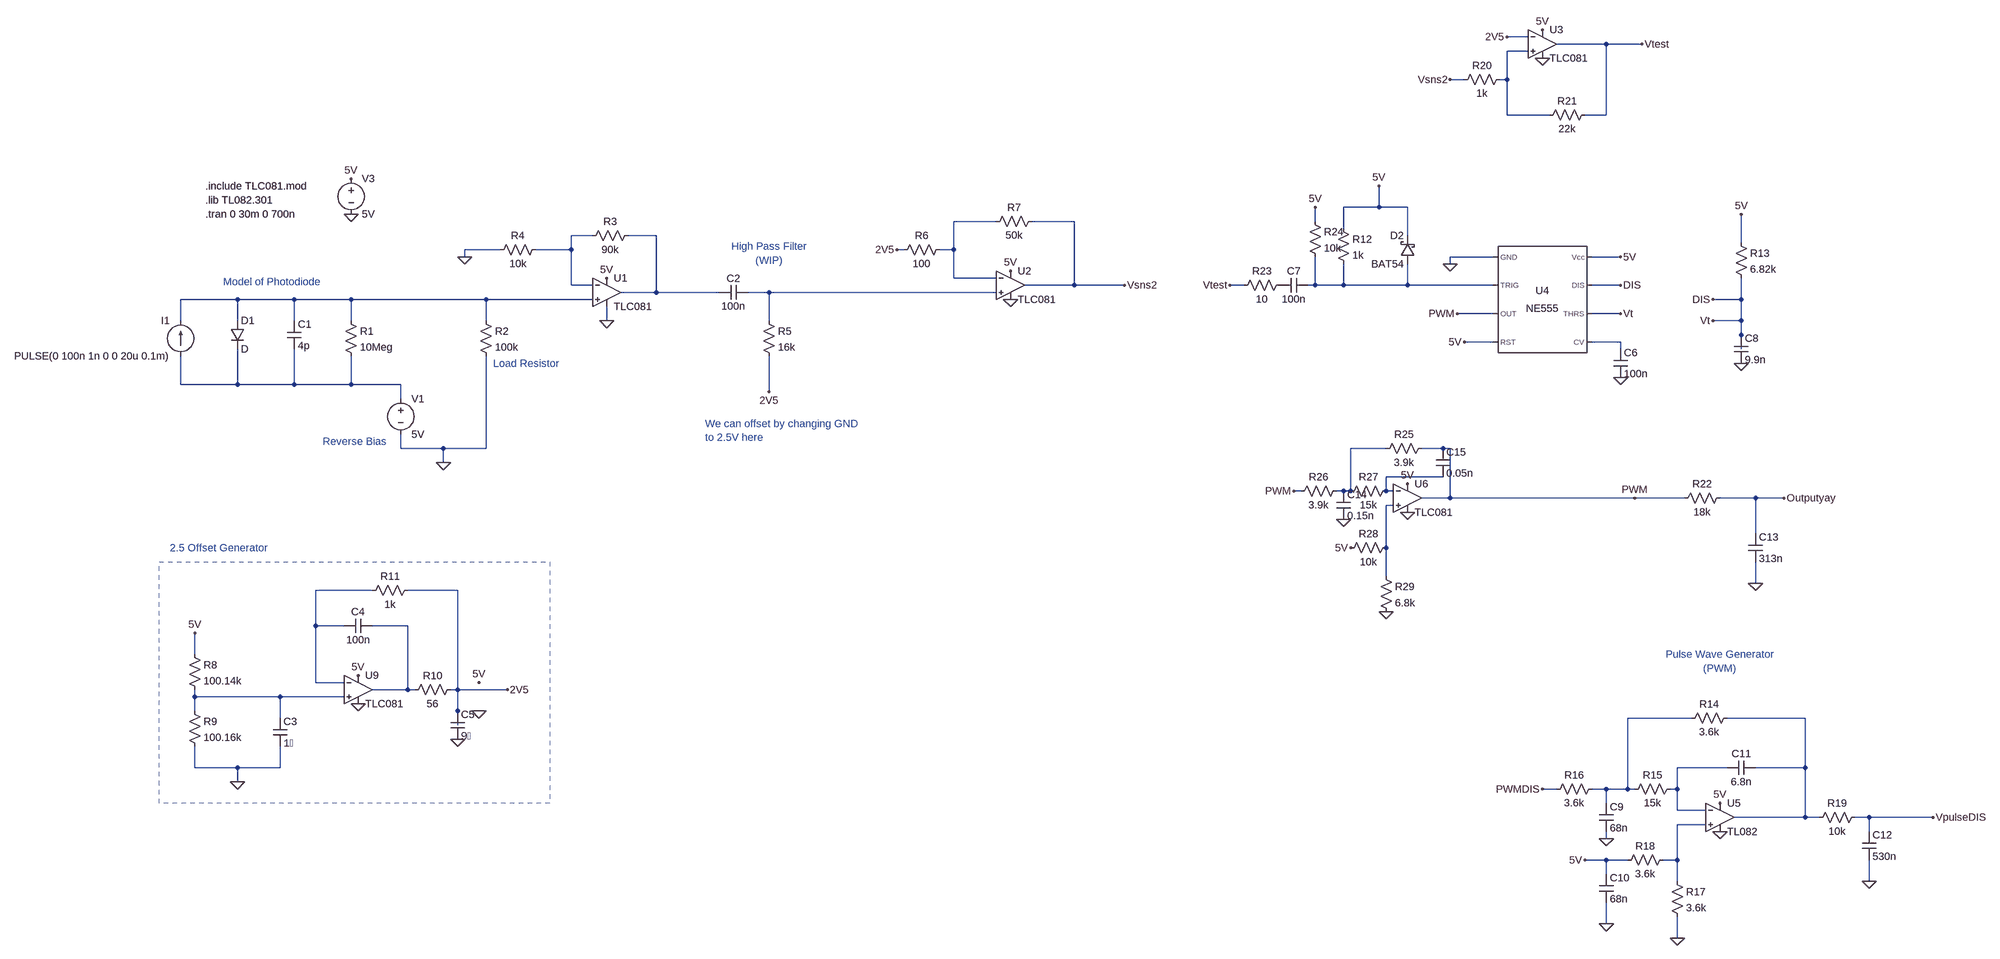
[diagram p0: schematic alternative_rx.asc]
alternative_rx.asc, the LTspice schematic file:
Version 4
SHEET 1 5060 1620
WIRE 3264 -432 3216 -432
WIRE 3440 -416 3328 -416
WIRE 3520 -416 3440 -416
WIRE 3264 -400 3216 -400
WIRE 3120 -336 3088 -336
WIRE 3216 -336 3216 -400
WIRE 3216 -336 3200 -336
WIRE 3216 -256 3216 -336
WIRE 3312 -256 3216 -256
WIRE 3440 -256 3440 -416
WIRE 3440 -256 3392 -256
WIRE 2928 -48 2928 -96
WIRE 2928 -48 2848 -48
WIRE 2992 -48 2928 -48
WIRE 1984 -16 1888 -16
WIRE 2160 -16 2064 -16
WIRE 2784 -16 2784 -48
WIRE 2848 0 2848 -48
WIRE 1056 16 1008 16
WIRE 1200 16 1136 16
WIRE 2992 16 2992 -48
WIRE 3744 32 3744 -32
WIRE 848 48 768 48
WIRE 1008 48 1008 16
WIRE 1008 48 928 48
WIRE 1776 48 1760 48
WIRE 1888 48 1888 -16
WIRE 1888 48 1856 48
WIRE 768 64 768 48
WIRE 3184 64 3088 64
WIRE 3472 64 3408 64
WIRE 3088 80 3088 64
WIRE 1888 112 1888 48
WIRE 1984 112 1888 112
WIRE 1008 128 1008 48
WIRE 1056 128 1008 128
WIRE 2160 128 2160 -16
WIRE 2160 128 2048 128
WIRE 2336 128 2160 128
WIRE 2624 128 2592 128
WIRE 2784 128 2784 64
WIRE 2784 128 2768 128
WIRE 2848 128 2848 80
WIRE 2848 128 2784 128
WIRE 2992 128 2992 80
WIRE 2992 128 2848 128
WIRE 3184 128 2992 128
WIRE 3472 128 3408 128
WIRE 1200 144 1200 16
WIRE 1200 144 1120 144
WIRE 1360 144 1200 144
WIRE 1472 144 1424 144
WIRE 1984 144 1472 144
WIRE 256 160 128 160
WIRE 384 160 256 160
WIRE 512 160 384 160
WIRE 816 160 512 160
WIRE 1056 160 816 160
WIRE 3744 160 3744 112
WIRE 3744 160 3680 160
WIRE 3184 192 3104 192
WIRE 3472 192 3408 192
WIRE 128 208 128 160
WIRE 256 208 256 160
WIRE 384 208 384 160
WIRE 512 208 512 160
WIRE 816 208 816 160
WIRE 1088 208 1088 176
WIRE 1472 208 1472 144
WIRE 3744 208 3744 160
WIRE 3744 208 3680 208
WIRE 3744 240 3744 208
WIRE 3184 256 3120 256
WIRE 3472 256 3408 256
WIRE 3472 272 3472 256
WIRE 3744 272 3744 240
WIRE 128 352 128 288
WIRE 256 352 256 272
WIRE 256 352 128 352
WIRE 384 352 384 272
WIRE 384 352 256 352
WIRE 512 352 512 288
WIRE 512 352 384 352
WIRE 624 352 512 352
WIRE 1472 368 1472 288
WIRE 624 384 624 352
WIRE 624 496 624 464
WIRE 720 496 624 496
WIRE 816 496 816 288
WIRE 816 496 720 496
WIRE 2944 496 2864 496
WIRE 3072 496 3024 496
WIRE 3088 496 3072 496
WIRE 720 528 720 496
WIRE 3072 560 2944 560
WIRE 2752 592 2736 592
WIRE 2848 592 2832 592
WIRE 2864 592 2864 496
WIRE 2864 592 2848 592
WIRE 2944 592 2944 560
WIRE 2960 592 2944 592
WIRE 3088 608 3088 496
WIRE 3088 608 3024 608
WIRE 3504 608 3088 608
WIRE 3616 608 3504 608
WIRE 3776 608 3696 608
WIRE 3840 608 3776 608
WIRE 2960 624 2944 624
WIRE 3776 688 3776 608
WIRE 2944 720 2944 624
WIRE 2944 784 2944 720
WIRE 3776 800 3776 752
WIRE 560 816 432 816
WIRE 752 816 640 816
WIRE 432 896 432 816
WIRE 496 896 432 896
WIRE 640 896 560 896
WIRE 160 960 160 912
WIRE 432 1024 432 896
WIRE 496 1024 432 1024
WIRE 640 1040 640 896
WIRE 640 1040 560 1040
WIRE 656 1040 640 1040
WIRE 752 1040 752 816
WIRE 752 1040 736 1040
WIRE 864 1040 752 1040
WIRE 160 1056 160 1040
WIRE 352 1056 160 1056
WIRE 496 1056 352 1056
WIRE 160 1088 160 1056
WIRE 752 1088 752 1040
WIRE 352 1104 352 1056
WIRE 3632 1104 3488 1104
WIRE 3888 1104 3712 1104
WIRE 752 1120 752 1088
WIRE 160 1216 160 1168
WIRE 256 1216 160 1216
WIRE 352 1216 352 1168
WIRE 352 1216 256 1216
WIRE 3712 1216 3600 1216
WIRE 3888 1216 3888 1104
WIRE 3888 1216 3776 1216
WIRE 256 1248 256 1216
WIRE 3328 1264 3296 1264
WIRE 3440 1264 3408 1264
WIRE 3488 1264 3488 1104
WIRE 3488 1264 3440 1264
WIRE 3504 1264 3488 1264
WIRE 3600 1264 3600 1216
WIRE 3600 1264 3584 1264
WIRE 3440 1296 3440 1264
WIRE 3600 1312 3600 1264
WIRE 3664 1312 3600 1312
WIRE 3888 1328 3888 1216
WIRE 3888 1328 3728 1328
WIRE 3920 1328 3888 1328
WIRE 4032 1328 4000 1328
WIRE 4176 1328 4032 1328
WIRE 3664 1344 3600 1344
WIRE 4032 1360 4032 1328
WIRE 3440 1376 3440 1360
WIRE 3440 1424 3392 1424
WIRE 3488 1424 3440 1424
WIRE 3600 1424 3600 1344
WIRE 3600 1424 3568 1424
WIRE 3440 1456 3440 1424
WIRE 3600 1472 3600 1424
WIRE 4032 1472 4032 1424
WIRE 3440 1568 3440 1520
WIRE 3600 1600 3600 1552
FLAG 720 528 0
FLAG 1088 208 0
FLAG 768 64 0
FLAG 1760 48 2V5
FLAG 2336 128 Vsns2
FLAG 512 -32 0
FLAG 512 -112 5V
FLAG 160 912 5V
FLAG 256 1248 0
FLAG 752 1152 0
FLAG 864 1040 2V5
FLAG 3088 80 0
FLAG 3472 336 0
FLAG 3472 192 Vt
FLAG 3472 128 DIS
FLAG 3472 64 5V
FLAG 2928 -96 5V
FLAG 3120 256 5V
FLAG 3104 192 PWM
FLAG 3744 304 0
FLAG 3680 160 DIS
FLAG 3680 208 Vt
FLAG 3744 -32 5V
FLAG 3600 1600 0
FLAG 3440 1376 0
FLAG 3440 1568 0
FLAG 3392 1424 5V
FLAG 3296 1264 PWMDIS
FLAG 4032 1472 0
FLAG 4176 1328 VpulseDIS
FLAG 1472 368 2V5
FLAG 3088 -336 Vsns2
FLAG 3216 -432 2V5
FLAG 3520 -416 Vtest
FLAG 1088 112 5V
FLAG 2016 96 5V
FLAG 2016 160 0
FLAG 800 1088 0
FLAG 800 1024 5V
FLAG 3296 -384 0
FLAG 3296 -448 5V
FLAG 528 1072 0
FLAG 528 1008 5V
FLAG 3696 1360 0
FLAG 3696 1296 5V
FLAG 3504 608 PWM
FLAG 3776 800 0
FLAG 3840 608 Outputyay
FLAG 2592 128 Vtest
FLAG 2784 -48 5V
FLAG 2992 576 5V
FLAG 2992 640 0
FLAG 2736 592 PWM
FLAG 2848 656 0
FLAG 2864 720 5V
FLAG 2944 864 0
SYMBOL current 128 288 R180
WINDOW 0 24 80 Left 2
WINDOW 3 24 0 Left 2
WINDOW 123 0 0 Left 0
WINDOW 39 0 0 Left 0
SYMATTR InstName I1
SYMATTR Value PULSE(0 100n 1n 0 0 20u 0.1m)
SYMBOL diode 240 208 R0
SYMATTR InstName D1
SYMBOL cap 368 208 R0
SYMATTR InstName C1
SYMATTR Value 4p
SYMBOL res 496 192 R0
SYMATTR InstName R1
SYMATTR Value 10Meg
SYMBOL voltage 624 368 R0
WINDOW 123 0 0 Left 0
WINDOW 39 0 0 Left 0
SYMATTR InstName V1
SYMATTR Value 5V
SYMBOL res 800 192 R0
SYMATTR InstName R2
SYMATTR Value 100k
SYMBOL res 1152 0 R90
WINDOW 0 0 56 VBottom 2
WINDOW 3 32 56 VTop 2
SYMATTR InstName R3
SYMATTR Value 90k
SYMBOL res 944 32 R90
WINDOW 0 0 56 VBottom 2
WINDOW 3 32 56 VTop 2
SYMATTR InstName R4
SYMATTR Value 10k
SYMBOL cap 1424 128 R90
WINDOW 0 0 32 VBottom 2
WINDOW 3 32 32 VTop 2
SYMATTR InstName C2
SYMATTR Value 100n
SYMBOL res 1456 192 R0
SYMATTR InstName R5
SYMATTR Value 16k
SYMBOL res 1872 32 R90
WINDOW 0 0 56 VBottom 2
WINDOW 3 32 56 VTop 2
SYMATTR InstName R6
SYMATTR Value 100
SYMBOL res 2080 -32 R90
WINDOW 0 0 56 VBottom 2
WINDOW 3 32 56 VTop 2
SYMATTR InstName R7
SYMATTR Value 50k
SYMBOL voltage 512 -128 R0
SYMATTR InstName V3
SYMATTR Value 5V
SYMBOL res 144 944 R0
SYMATTR InstName R8
SYMATTR Value 100.14k
SYMBOL res 144 1072 R0
SYMATTR InstName R9
SYMATTR Value 100.16k
SYMBOL cap 336 1104 R0
SYMATTR InstName C3
SYMATTR Value 1�
SYMBOL cap 560 880 R90
WINDOW 0 0 32 VBottom 2
WINDOW 3 32 32 VTop 2
SYMATTR InstName C4
SYMATTR Value 100n
SYMBOL res 752 1024 R90
WINDOW 0 0 56 VBottom 2
WINDOW 3 32 56 VTop 2
SYMATTR InstName R10
SYMATTR Value 56
SYMBOL res 656 800 R90
WINDOW 0 0 56 VBottom 2
WINDOW 3 32 56 VTop 2
SYMATTR InstName R11
SYMATTR Value 1k
SYMBOL cap 736 1088 R0
SYMATTR InstName C5
SYMATTR Value 9�
SYMBOL NE555 3296 160 R0
SYMATTR InstName U4
SYMBOL cap 3456 272 R0
SYMATTR InstName C6
SYMATTR Value 100n
SYMBOL schottky 3008 80 R180
WINDOW 0 24 64 Left 2
WINDOW 3 24 0 Left 2
SYMATTR InstName D2
SYMATTR Value BAT54
SYMBOL res 2832 -16 R0
SYMATTR InstName R12
SYMATTR Value 1k
SYMBOL cap 2768 112 R90
WINDOW 0 0 32 VBottom 2
WINDOW 3 32 32 VTop 2
SYMATTR InstName C7
SYMATTR Value 100n
SYMBOL res 3728 16 R0
SYMATTR InstName R13
SYMATTR Value 6.82k
SYMBOL cap 3728 240 R0
SYMATTR InstName C8
SYMATTR Value 9.9n
SYMBOL res 3728 1088 R90
WINDOW 0 0 56 VBottom 2
WINDOW 3 32 56 VTop 2
SYMATTR InstName R14
SYMATTR Value 3.6k
SYMBOL res 3600 1248 R90
WINDOW 0 0 56 VBottom 2
WINDOW 3 32 56 VTop 2
SYMATTR InstName R15
SYMATTR Value 15k
SYMBOL res 3424 1248 R90
WINDOW 0 0 56 VBottom 2
WINDOW 3 32 56 VTop 2
SYMATTR InstName R16
SYMATTR Value 3.6k
SYMBOL cap 3424 1296 R0
SYMATTR InstName C9
SYMATTR Value 68n
SYMBOL res 3584 1456 R0
SYMATTR InstName R17
SYMATTR Value 3.6k
SYMBOL res 3584 1408 R90
WINDOW 0 0 56 VBottom 2
WINDOW 3 32 56 VTop 2
SYMATTR InstName R18
SYMATTR Value 3.6k
SYMBOL cap 3424 1456 R0
SYMATTR InstName C10
SYMATTR Value 68n
SYMBOL cap 3776 1200 R90
WINDOW 0 0 32 VBottom 2
WINDOW 3 32 32 VTop 2
SYMATTR InstName C11
SYMATTR Value 6.8n
SYMBOL cap 4016 1360 R0
SYMATTR InstName C12
SYMATTR Value 530n
SYMBOL res 4016 1312 R90
WINDOW 0 0 56 VBottom 2
WINDOW 3 32 56 VTop 2
SYMATTR InstName R19
SYMATTR Value 10k
SYMBOL res 3216 -352 R90
WINDOW 0 0 56 VBottom 2
WINDOW 3 32 56 VTop 2
SYMATTR InstName R20
SYMATTR Value 1k
SYMBOL res 3408 -272 R90
WINDOW 0 0 56 VBottom 2
WINDOW 3 32 56 VTop 2
SYMATTR InstName R21
SYMATTR Value 22k
SYMBOL opamp2 1088 80 R0
SYMATTR InstName U1
SYMATTR Value TLC081
SYMBOL opamp2 2016 64 R0
SYMATTR InstName U2
SYMATTR Value TLC081
SYMBOL opamp2 528 976 R0
SYMATTR InstName U9
SYMATTR Value TLC081
SYMBOL opamp2 3696 1264 R0
SYMATTR InstName U5
SYMATTR Value TL082
SYMBOL opamp2 3296 -480 R0
SYMATTR InstName U3
SYMATTR Value TLC081
SYMBOL Res 3712 592 R90
WINDOW 0 0 56 VBottom 2
WINDOW 3 32 56 VTop 2
SYMATTR InstName R22
SYMATTR Value 18k
SYMBOL Cap 3760 688 R0
SYMATTR InstName C13
SYMATTR Value 313n
SYMBOL Res 2720 112 R90
WINDOW 0 0 56 VBottom 2
WINDOW 3 32 56 VTop 2
SYMATTR InstName R23
SYMATTR Value 10
SYMBOL Res 2768 -32 R0
SYMATTR InstName R24
SYMATTR Value 10k
SYMBOL opamp2 2992 544 R0
SYMATTR InstName U6
SYMATTR Value TLC081
SYMBOL res 3040 480 R90
WINDOW 0 0 56 VBottom 2
WINDOW 3 32 56 VTop 2
SYMATTR InstName R25
SYMATTR Value 3.9k
SYMBOL res 2848 576 R90
WINDOW 0 0 56 VBottom 2
WINDOW 3 32 56 VTop 2
SYMATTR InstName R26
SYMATTR Value 3.9k
SYMBOL res 2960 576 R90
WINDOW 0 0 56 VBottom 2
WINDOW 3 32 56 VTop 2
SYMATTR InstName R27
SYMATTR Value 15k
SYMBOL cap 2832 592 R0
SYMATTR InstName C14
SYMATTR Value 0.15n
SYMBOL cap 3056 496 R0
SYMATTR InstName C15
SYMATTR Value 0.05n
SYMBOL res 2960 704 R90
WINDOW 0 0 56 VBottom 2
WINDOW 3 32 56 VTop 2
SYMATTR InstName R28
SYMATTR Value 10k
SYMBOL res 2928 768 R0
SYMATTR InstName R29
SYMATTR Value 6.8k
TEXT 832 304 Left 2 ;Load Resistor
TEXT 184 -32 Left 2 !.tran 0 30m 0 700n
TEXT 224 120 Left 2 ;Model of Photodiode
TEXT 448 480 Left 2 ;Reverse Bias
TEXT 1472 56 Center 2 ;High Pass Filter\n(WIP)
TEXT 1328 440 Left 2 ;We can offset by changing GND\nto 2.5V here
TEXT 3696 976 Center 2 ;Pulse Wave Generator\n(PWM)
TEXT 104 720 Left 2 ;2.5 Offset Generator
TEXT 184 -64 Left 2 !.lib TL082.301
TEXT 184 -96 Left 2 !.include TLC081.mod
RECTANGLE Normal 960 1296 80 752 2

The netlist it stands for:
* alternative_rx.asc
I1 N009 N007 PULSE(0 100n 1n 0 0 20u 0.1m)
D1 N007 N009 D
C1 N007 N009 4p
R1 N007 N009 10Meg
V1 N009 0 5V
R2 N007 0 100k
R3 N004 N003 90k
R4 N003 0 10k
C2 N006 N004 100n
R5 N006 2V5 16k
R6 N002 2V5 100
R7 Vsns2 N002 50k
V3 5V 0 5V
R8 5V N015 100.14k
R9 N015 0 100.16k
C3 N015 0 1�
C4 N014 N013 100n
R10 2V5 N014 56
R11 2V5 N013 1k
C5 2V5 0 9�
XU4 0 N005 PWM 5V N008 DIS DIS 5V NE555  ; pins GND TRIG OUT RST CV THRS DIS Vcc
C6 N008 0 100n
D2 N005 5V BAT54
R12 5V N005 1k
C7 N005 P001 100n
R13 5V DIS 6.82k
C8 DIS 0 9.9n
R14 N017 N016 3.6k
R15 N018 N016 15k
R16 N016 PWMDIS 3.6k
C9 N016 0 68n
R17 N019 0 3.6k
R18 N019 5V 3.6k
C10 5V 0 68n
C11 N017 N018 6.8n
C12 VpulseDIS 0 530n
R19 VpulseDIS N017 10k
R20 N001 Vsns2 1k
R21 Vtest N001 22k
XU1 N007 N003 5V 0 N004 TLC081  ; pins In+ In- V+ V- OUT
XU2 N006 N002 5V 0 Vsns2 TLC081  ; pins In+ In- V+ V- OUT
XU9 N015 N013 5V 0 N014 TLC081  ; pins In+ In- V+ V- OUT
XU5 N019 N018 5V 0 N017 TL082  ; pins In+ In- V+ V- OUT
XU3 N001 2V5 5V 0 Vtest TLC081  ; pins In+ In- V+ V- OUT
R22 Outputyay PWM 18k
C13 Outputyay 0 313n
R23 P001 Vtest 10
R24 5V N005 10k
XU6 N012 N011 5V 0 PWM TLC081  ; pins In+ In- V+ V- OUT
R25 PWM N010 3.9k
R26 N010 PWM 3.9k
R27 N011 N010 15k
C14 N010 0 0.15n
C15 PWM N011 0.05n
R28 N012 5V 10k
R29 N012 0 6.8k
.model D D
.lib standard.dio
* Load Resistor
.tran 0 30m 0 700n
* Model of Photodiode
* Reverse Bias
* High Pass Filter
* (WIP)
* We can offset by changing GND
* to 2.5V here
* Pulse Wave Generator
* (PWM)
* 2.5 Offset Generator
.lib TL082.301
.include TLC081.mod
.lib NE555.sub
.backanno
.end